# EAGLE design groupe11finis2 (EAGLE 9.3.0)
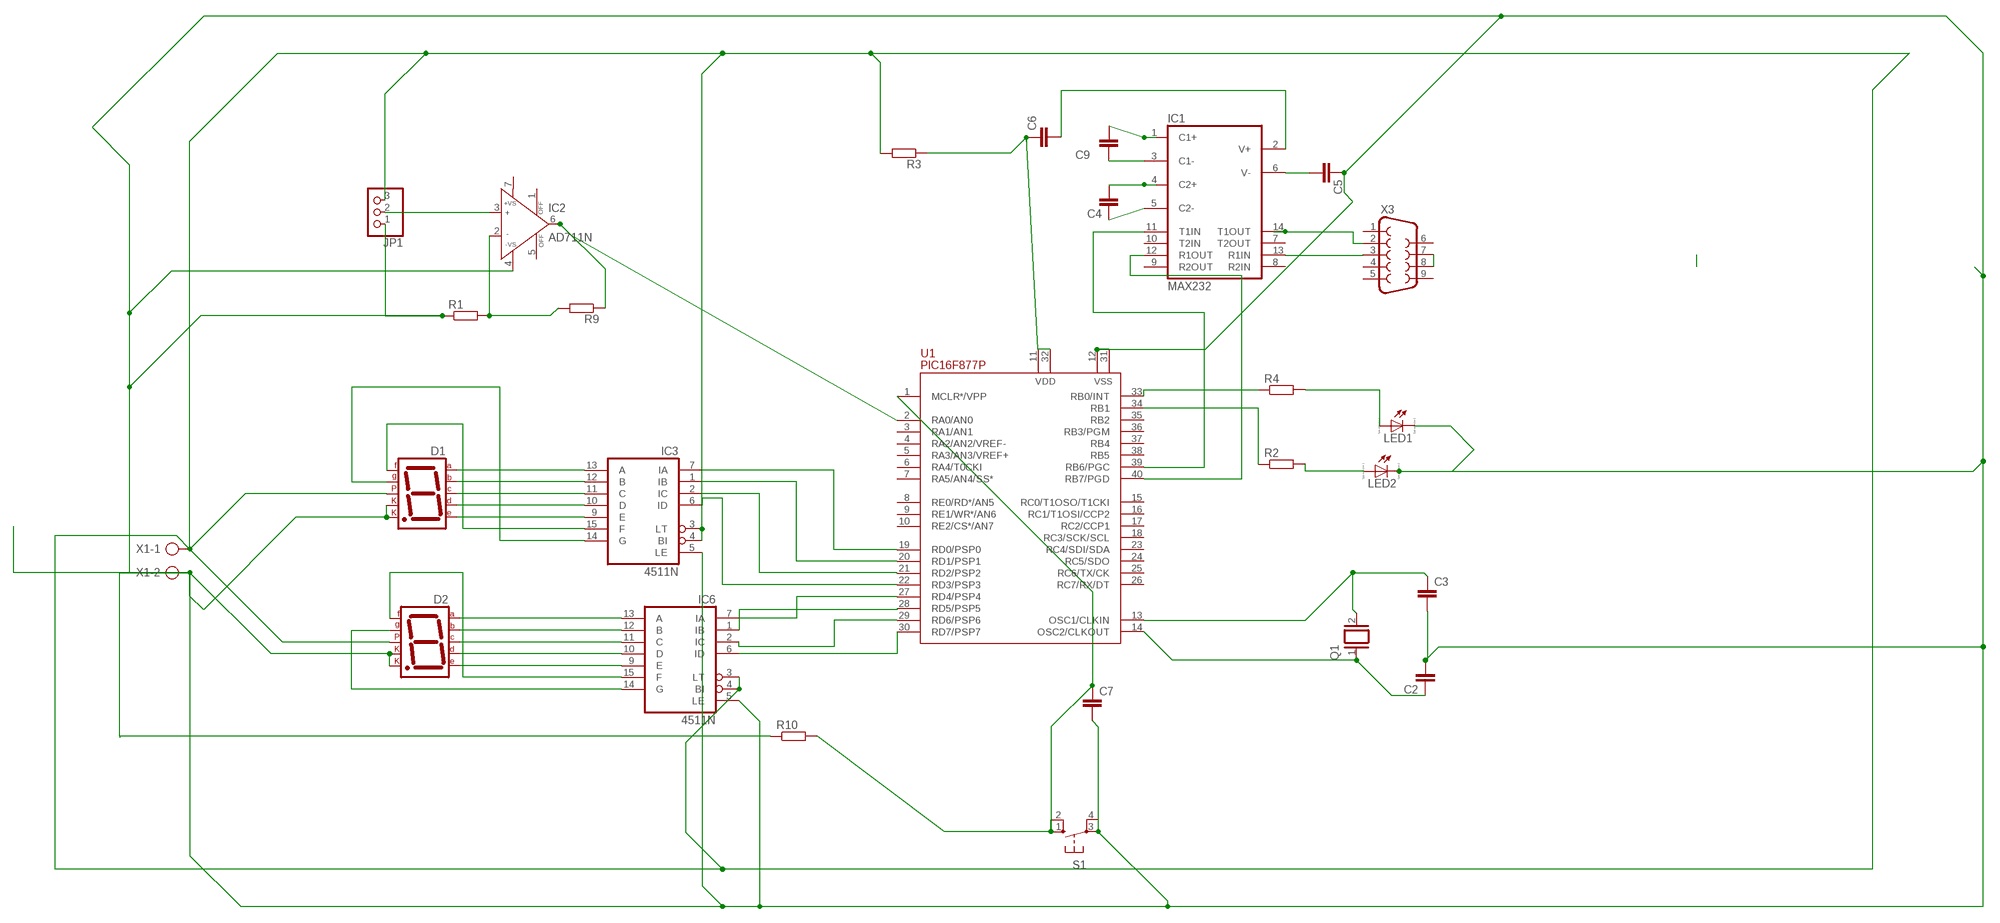
[diagram p0: schematic, sheet 1]

## Parts
C2  C-EU025-024X044  [C025-024X044]
C3  C-EU025-024X044  [C025-024X044]
C4  C-EU025-024X044  [C025-024X044]
C5  C-EU025-024X044  [C025-024X044]
C6  C-EU025-024X044  [C025-024X044]
C7  C-EU025-024X044  [C025-024X044]
C9  C-EU025-024X044  [C025-024X044]
D1  7SEG-CK  [7SEG-13]
D2  7SEG-CK  [7SEG-13]
IC1  MAX232  [DIL16]
IC2  AD711N  [DIL08]
IC3  4511N  [DIL16]
IC6  4511N  [DIL16]
JP1  PINHD-1X3  [1X03]
LED1  LED_ELD260  [LED_LD260]
LED2  LED_ELD260  [LED_LD260]
Q1  XTAL/S  [QS]
R1  R-EU_0207/10  [0207/10]
R2  R-EU_0207/10  [0207/10]
R3  R-EU_0207/10  [0207/10]
R4  R-EU_0207/10  [0207/10]
R9  R-EU_0207/10  [0207/10]
R10  R-EU_0207/10  [0207/10]
S1  10-XX  [B3F-10XX]
U1  PIC16F877P  [DIL40]
X1  AK300/2  [AK300/2]
X3  F09V  [F09V]

## Nets
N$1: IC1.13(R1IN) X3.3
N$2: C9.2 IC1.1(C1+)
N$3: IC1.14(T1OUT) X3.2
N$4: C9.1 IC1.3(C1-)
N$5: IC1.11(T1IN) U1.39(RB6/PGC)
N$6: C4.2 IC1.4(C2+)
N$7: IC1.12(R1OUT) U1.40(RB7/PGD)
N$8: C4.1 IC1.5(C2-)
N$10: C6.2 IC1.2(V+)
N$11: C5.2 IC1.6(V-)
N$12: IC3.7(IA) U1.19(RD0/PSP0)
N$13: IC3.1(IB) U1.20(RD1/PSP1)
N$14: IC3.2(IC) U1.21(RD2/PSP2)
N$15: IC3.6(ID) U1.22(RD3/PSP3)
N$16: IC6.7(IA) U1.27(RD4/PSP4)
N$17: IC6.1(IB) U1.28(RD5/PSP5)
N$18: IC6.2(IC) U1.29(RD6/PSP6)
N$19: IC6.6(ID) U1.30(RD7/PSP7)
N$20: D1.7(A) IC3.13(A)
N$21: D1.6(B) IC3.12(B)
N$22: D1.4(C) IC3.11(C)
N$23: D1.2(D) IC3.10(D)
N$24: D1.1(E) IC3.9(E)
N$25: D1.9(F) IC3.15(F)
N$26: D1.10(G) IC3.14(G)
N$27: D2.7(A) IC6.13(A)
N$28: LED2.A R2.2
N$29: D2.6(B) IC6.12(B)
N$30: R2.1 U1.34(RB1)
N$31: D2.2(D) IC6.10(D)
N$32: D2.1(E) IC6.9(E)
N$33: D2.9(F) IC6.15(F)
N$34: D2.10(G) IC6.14(G)
N$35: R4.1 U1.33(RB0/INT)
N$36: IC2.3(IN+) JP1.2
N$37: LED1.A R4.2
N$38: IC2.2(IN-) R1.2 R9.2
N$39: C3.1 Q1.2 U1.13(OSC1/CLKIN)
N$41: C7.1 R10.2 S1.1(S) S1.2(S1) U1.1(MCLR*/VPP)
N$42: C2.1 Q1.1 U1.14(OSC2/CLKOUT)
N$43: X3.7 X3.8
N$45: IC2.6(OUT) R9.1 U1.2(RA0/AN0)
N$46: C6.1 R3.1 U1.11(VDD) U1.32(VDD)
N$47: D2.4(C) IC6.11(C)
N$52: D1.5(DP) D2.5(DP) IC3.3(LT) IC3.4(BI) IC6.3(LT) IC6.4(BI) JP1.3 R3.2 X1.1
N$53: C2.2 C3.2 C5.1 C7.2 D1.3(CK1) D1.8(CK2) D2.3(CK1) D2.8(CK2) IC2.4(-VS) IC3.5(LE) IC6.5(LE) JP1.1 LED1.K(C) LED2.K(C) R1.1 R10.1 S1.3(P) S1.4(P1) U1.12(VSS) U1.31(VSS) X1.2
Unconnected: IC1.7(T2OUT) IC1.8(R2IN) IC1.9(R2OUT) IC1.10(T2IN) IC2.1(OFF) IC2.5(OFF) IC2.7(+VS) U1.3(RA1/AN1) U1.4(RA2/AN2/VREF-) U1.5(RA3/AN3/VREF+) U1.6(RA4/T0CKI) U1.7(RA5/AN4/SS*) U1.8(RE0/RD*/AN5) U1.9(RE1/WR*/AN6) U1.10(RE2/CS*/AN7) U1.15(RC0/T1OSO/T1CKI) U1.16(RC1/T1OSI/CCP2) U1.17(RC2/CCP1) U1.18(RC3/SCK/SCL) U1.23(RC4/SDI/SDA) U1.24(RC5/SDO) U1.25(RC6/TX/CK) U1.26(RC7/RX/DT) U1.35(RB2) U1.36(RB3/PGM) U1.37(RB4) U1.38(RB5) X3.1 X3.4 X3.5 X3.6 X3.9

## Power pins joined to a net without a drawn wire
GND: IC1.15(GND)
VCC: IC1.16(VCC)
VDD: IC3.16(VDD) IC6.16(VDD)
VSS: IC3.8(VSS) IC6.8(VSS)

## Library data of the parts
C2-C7 C9 = rcl:C-EU: CAPACITOR, European symbol
D1 D2 = special:7SEG-CK: 7-segment DISPLAY single cathode, 13 mm
IC1 = maxim:MAX232: RS232 TRANSCEIVER; MF: MAXIM; MPN: MAX232ACPE+; OC_FARNELL: 9723773; OC_NEWARK: 68K4544
IC2 = analog-devices:AD711: Precision, Low Cost, High Speed, BiFET Op Amp Source: http://www.analog.com/static/imported-files/data_sheets/AD711.pdf; MPN: AD711BQ; OC_FARNELL: 9604839; OC_NEWARK: 66F5826
IC3 IC6 = 45xx:4511: BCD to 7-segment LATCH/DECODER/DRIVER
JP1 = pinhead:PINHD-1X3: PIN HEADER
LED1 LED2 = eagle-ltspice:LED_E: LED Source: http://www.osram.convergy.de Source: www.luxeon.com Source: www.kingbright.com; SPICEMODEL: NONE; SPICEPREFIX: D; SPICETYPE: diode
Q1 = special:XTAL/S: CRYSTAL
R1-R4 R9 R10 = rcl:R-EU_: RESISTOR, European symbol
S1 = switch-omron:10-XX: OMRON SWITCH; MPN: B3F-1000; OC_FARNELL: 176432; OC_NEWARK: 36M3542
U1 = pic16f87x:PIC16F877: FLASH MICROCONTROLLER
X1 = con-ptr500:AK300/2: CONNECTOR; OC_FARNELL: unknown; OC_NEWARK: unknown
X3 = con-subd:F09: SUB-D; OC_FARNELL: unknown; OC_NEWARK: unknown

## Board
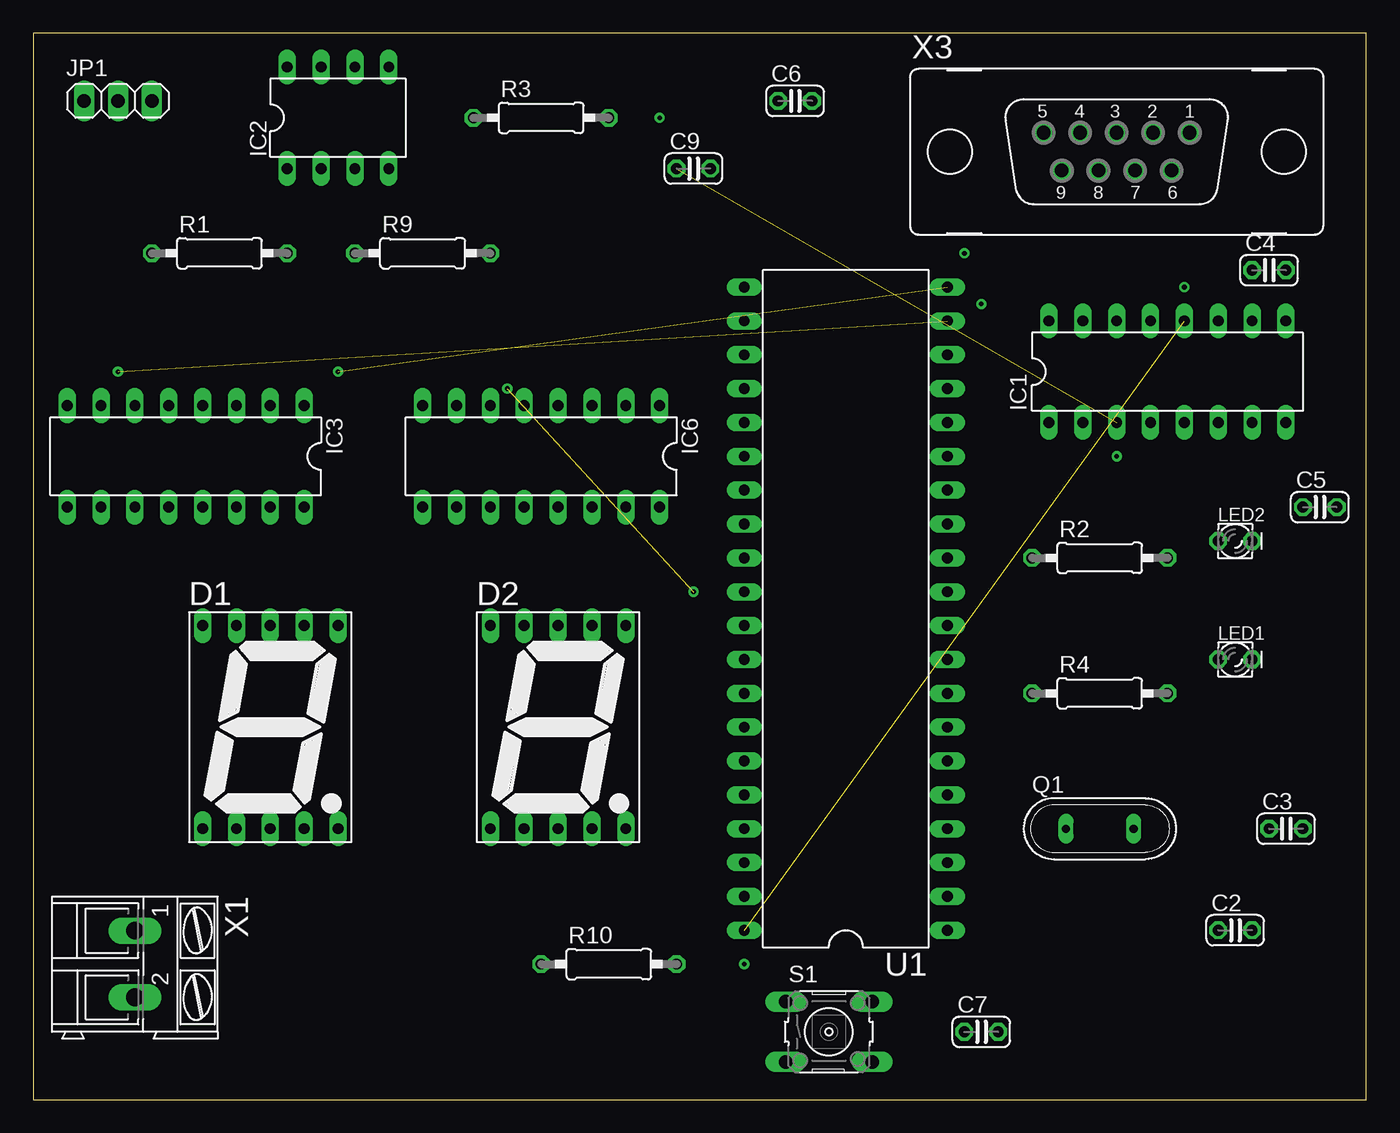
[diagram p1: board, top side]
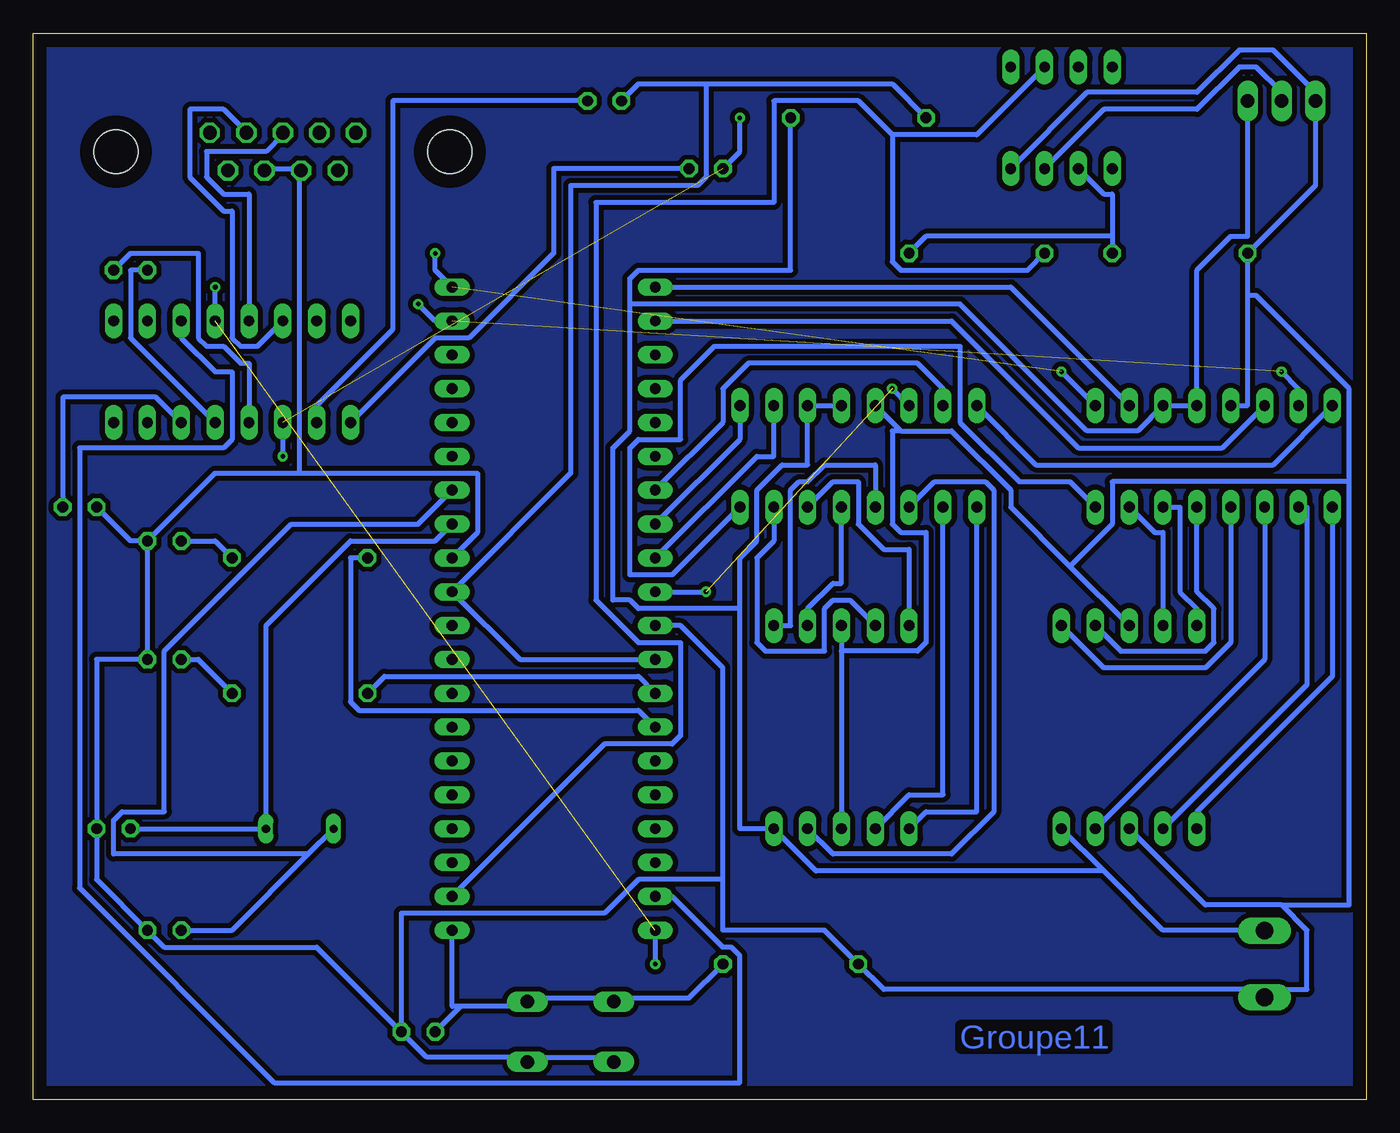
[diagram p2: board, bottom side, seen from below]

Size 100 x 80 mm. Coordinates in mm from the lower left corner, seen from the top.
Outline: 0,0 100,0 100,80 0,80 0,0
Copper layers (1*16): Top 0.035mm / dielectric 1.5mm / Bottom 0.035mm
Design rules "default *": minimum track width 15mil, minimum drill 0.35mm, track to track 15mil, track to pad 15mil, pad to pad 15mil, via to via 15mil, smd to smd 6mil, copper to edge 40mil, drill to drill 6mil, minimum pad ring 10mil, minimum via ring 8mil, stop-mask expansion 4mil, vias tented up to drill 0mil, thermal gap 10mil

### Footprints (pad centres in the part's own frame; a part is rotated, then mirrored left to right if it is on the bottom)
C025-024X044 = drill 0.813 octagon: 1 -1.27,0; 2 1.27,0
7SEG-13 = drill 0.813 long: 1 -5.08,-7.62; 2 -2.54,-7.62; 3 0,-7.62; 4 2.54,-7.62; 5 5.08,-7.62; 6 5.08,7.62; 7 2.54,7.62; 8 0,7.62; 9 -2.54,7.62; 10 -5.08,7.62
DIL16 = drill 0.813 long: 1 -8.89,-3.81; 2 -6.35,-3.81; 3 -3.81,-3.81; 4 -1.27,-3.81; 5 1.27,-3.81; 6 3.81,-3.81; 7 6.35,-3.81; 8 8.89,-3.81; 9 8.89,3.81; 10 6.35,3.81; 11 3.81,3.81; 12 1.27,3.81; 13 -1.27,3.81; 14 -3.81,3.81; 15 -6.35,3.81; 16 -8.89,3.81
DIL08 = drill 0.813 long: 1 -3.81,-3.81; 2 -1.27,-3.81; 3 1.27,-3.81; 4 3.81,-3.81; 5 3.81,3.81; 6 1.27,3.81; 7 -1.27,3.81; 8 -3.81,3.81
1X03 = drill 1.016 long: 1 -2.54,0; 2 0,0; 3 2.54,0
LED_LD260 = drill 0.813 octagon: A -1.27,0; K 1.27,0
QS = drill 0.61 long: 1 -2.54,0; 2 2.54,0
0207/10 = drill 0.813 octagon: 1 -5.08,0; 2 5.08,0
B3F-10XX = drill 1.016 long: 1 -3.251,2.261; 2 3.251,2.261; 3 -3.251,-2.261; 4 3.251,-2.261
DIL40 = drill 0.813 long: 1 -24.13,-7.62; 2 -21.59,-7.62; 3 -19.05,-7.62; 4 -16.51,-7.62; 5 -13.97,-7.62; 6 -11.43,-7.62; 7 -8.89,-7.62; 8 -6.35,-7.62; 9 -3.81,-7.62; 10 -1.27,-7.62; 11 1.27,-7.62; 12 3.81,-7.62; 13 6.35,-7.62; 14 8.89,-7.62; 15 11.43,-7.62; 16 13.97,-7.62; 17 16.51,-7.62; 18 19.05,-7.62; 19 21.59,-7.62; 20 24.13,-7.62; 21 24.13,7.62; 22 21.59,7.62; 23 19.05,7.62; 24 16.51,7.62; 25 13.97,7.62; 26 11.43,7.62; 27 8.89,7.62; 28 6.35,7.62; 29 3.81,7.62; 30 1.27,7.62; 31 -1.27,7.62; 32 -3.81,7.62; 33 -6.35,7.62; 34 -8.89,7.62; 35 -11.43,7.62; 36 -13.97,7.62; 37 -16.51,7.62; 38 -19.05,7.62; 39 -21.59,7.62; 40 -24.13,7.62
AK300/2 = drill 1.321 long: 1 -2.515,0; 2 2.489,0
F09V = drill 1.016 octagon: 1 5.486,1.422; 2 2.743,1.422; 3 0,1.422; 4 -2.743,1.422; 5 -5.486,1.422; 6 4.115,-1.422; 7 1.372,-1.422; 8 -1.372,-1.422; 9 -4.115,-1.422 | hole 3.302: -12.522,0; 12.522,0

### Placement (x,y rotation side)
C2  90.17,12.7 0 top
C3  93.98,20.32 0 top
C4  92.71,62.23 0 top
C5  96.52,44.45 0 top
C6  57.15,74.93 0 top
C7  71.12,5.08 0 top
C9  49.53,69.85 0 top
D1  17.78,27.94 0 top
D2  39.37,27.94 0 top
IC1  85.09,54.61 0 top
IC2  22.86,73.66 0 top
IC3  11.43,48.26 180 top
IC6  38.1,48.26 180 top
JP1  6.35,74.93 0 top
LED1  90.17,33.02 0 top
LED2  90.17,41.91 0 top
Q1  80.01,20.32 0 top
R1  13.97,63.5 0 top
R2  80.01,40.64 0 top
R3  38.1,73.66 0 top
R4  80.01,30.48 0 top
R9  29.21,63.5 0 top
R10  43.18,10.16 0 top
S1  59.69,5.08 0 top
U1  60.96,36.83 90 top
X1  7.62,10.16 270 top
X3  81.28,71.12 0 top

### Tracks (layer width: path | path; a pad name or v marks a point on that pad's centre or on a via)
N$1
  Bottom 0.381: IC1.13 83.82,67.94 85.72,67.94 87,69.22 87,71.12 82.55,71.12 81.28,72.39 X3.3
N$2
  Bottom 0.381: IC1.1 69.85,57.15 67.31,57.15 60.96,63.5 60.96,69.85 C9.2
N$3
  Bottom 0.381: IC1.14 83.19,56.52 84.45,56.52 85.09,57.15 85.09,66.67 85.72,66.67 88.27,69.22 88.27,74.3 85.72,74.3 84.45,73.03 X3.2
N$4  (via drill 0.35)  (1 unrouted)
  Bottom 0.381: IC1.3 v81.28,48.26 | C9.1 46.99,71.12 v46.99,73.66
N$5
  Bottom 0.381: U1.39 52.07,15.24 48.26,11.43 47.62,11.43 46.99,10.79 46.99,1.27 81.92,1.27 96.52,15.88 96.52,48.9 85.72,48.9 85.09,49.53 85.09,54.61 86.36,54.61 88.9,57.15 IC1.11
N$6
  Bottom 0.381: IC1.4 83.82,55.24 84.45,55.24 85.72,56.52 87,56.52 87.63,57.15 87.63,63.5 92.71,63.5 C4.2
N$7  (via drill 0.35)  (1 unrouted)
  Bottom 0.381: U1.40 53.34,10.16 | IC1.12 v86.36,60.96
N$8
  Bottom 0.381: IC1.5 92.71,57.15 92.71,62.23 C4.1
N$10
  Bottom 0.381: IC1.2 78.74,52.07 73.03,57.78 73.03,74.93 C6.2
N$11
  Bottom 0.381: C5.2 97.79,52.7 90.81,52.7 IC1.6
N$12  (via drill 0.35)  (1 unrouted)
  Bottom 0.381: IC3.7 5.08,53.34 v6.35,54.61 | U1.19 69.85,58.42 v71.12,59.69
N$13  (via drill 0.35)  (1 unrouted)
  Bottom 0.381: IC3.1 v22.86,54.61 | U1.20 69.85,62.23 v69.85,63.5
N$14
  Bottom 0.381: IC3.2 26.67,60.96 U1.21
N$15
  Bottom 0.381: IC3.6 10.79,48.9 21.59,48.9 31.11,58.42 U1.22
N$16
  Bottom 0.381: U1.27 48.26,50.8 48.26,53.34 46.35,55.24 33.66,55.24 31.75,53.34 IC6.7
N$17
  Bottom 0.381: U1.28 46.99,49.53 IC6.1
N$18
  Bottom 0.381: IC6.2 44.45,48.26 45.72,48.26 U1.29
N$19  (via drill 0.35)  (1 unrouted)
  Bottom 0.381: U1.30 v49.53,38.1 | IC6.6 v35.56,53.34
N$20
  Bottom 0.381: IC3.13 12.7,38.1 11.43,36.83 11.43,34.29 12.06,33.66 18.41,33.66 D1.7
N$21
  Bottom 0.381: D1.6 19.68,32.38 12.06,32.38 10.16,34.29 IC3.12
N$22
  Bottom 0.381: D1.4 7.62,33.02 IC3.11
N$23
  Bottom 0.381: D1.2 4.45,31.11 4.45,44.45 IC3.10
N$24
  Bottom 0.381: D1.1 12.7,21.59 2.54,31.75 IC3.9
N$25
  Bottom 0.381: D1.9 15.24,42.55 15.88,42.55 IC3.15
N$26
  Bottom 0.381: D1.10 12.7,36.83 13.97,38.1 13.97,44.45 IC3.14
N$27
  Bottom 0.381: IC6.13 39.37,38.73 40.01,38.73 41.91,36.83 D2.7
N$28
  Bottom 0.381: R2.2 86.36,41.91 LED2.A
N$29
  Bottom 0.381: IC6.12 36.83,47.62 40.64,47.62 41.91,46.35 42.55,46.35 43.18,45.72 43.18,35.56 D2.6
N$30
  Bottom 0.381: U1.34 54.61,29.21 75.56,29.21 76.2,29.84 76.2,40.64 R2.1
N$31
  Bottom 0.381: IC6.10 31.75,22.86 34.29,22.86 D2.2
N$32
  Bottom 0.381: IC6.9 29.21,21.59 33.02,21.59 D2.1
N$33
  Bottom 0.381: D2.9 38.73,37.47 40.01,37.47 40.64,36.83 40.64,33.66 45.09,33.66 45.72,34.29 45.72,40.64 44.45,41.91 IC6.15
N$34
  Bottom 0.381: D2.10 34.29,41.27 36.2,41.27 38.1,43.18 38.1,46.35 40.01,46.35 IC6.14
N$35
  Bottom 0.381: U1.33 54.61,31.75 73.66,31.75 R4.1
N$36
  Bottom 0.381: IC2.3 19.68,74.3 12.7,74.3 9.53,77.47 8.26,77.47 6.35,75.56 JP1.2
N$37
  Bottom 0.381: R4.2 87.63,33.02 LED1.A
N$38
  Bottom 0.381: 19.05,64.77 19.05,67.94 19.68,67.94 IC2.2 | 19.05,64.77 R1.2 | R9.2 33.02,64.77 19.05,64.77
N$39
  Bottom 0.381: C3.1 Q1.2 82.55,35.56 76.2,41.91 69.85,41.91 U1.13
N$40  (via drill 0.35)
  other vias: 53.34,10.16
N$41
  Bottom 0.381: R10.2 50.8,7.62 55.88,7.62 S1.1 56.52,7.62 62.87,7.62 S1.2 63.5,6.99 67.94,6.99 | 67.94,6.99 C7.1 | U1.1 68.58,6.99 67.94,6.99
N$42
  Bottom 0.381: 79.38,18.41 85.09,12.7 C2.1 | 79.38,18.41 Q1.1 | U1.14 71.12,43.18 80.64,43.18 90.17,33.66 90.17,21.59 93.34,21.59 93.98,20.95 93.98,18.41 79.38,18.41
N$43
  Bottom 0.381: X3.8 80.01,69.85 82.55,69.85 X3.7
N$45
  Bottom 0.381: R9.1 25.4,62.23 34.92,62.23 35.56,62.87 35.56,72.39 | 35.56,72.39 29.21,72.39 IC2.6 | U1.2 57.15,26.67 52.07,26.67 51.44,27.3 51.44,34.29 54.61,34.29 57.78,37.47 57.78,67.31 44.45,67.31 44.45,74.93 38.1,74.93 35.56,72.39
N$46
  Bottom 0.381: U1.32 63.5,33.02 U1.11 59.69,46.99 59.69,68.58 50.16,68.58 49.53,69.22 49.53,76.2 | R3.1 35.56,76.2 49.53,76.2 | 49.53,76.2 54.61,76.2 C6.1
N$47
  Bottom 0.381: D2.4 40.01,18.41 31.11,18.41 27.94,21.59 27.94,45.72 28.57,46.35 32.38,46.35 IC6.11
N$52
  Bottom 0.381: R3.2 43.18,62.23 54.61,62.23 55.24,61.59 55.24,59.69 | 55.24,59.69 30.48,59.69 20.95,50.16 17.14,50.16 IC3.3 IC3.4 12.7,62.23 10.16,64.77 8.89,64.77 JP1.3 | IC6.4 IC6.3 41.91,47.62 43.81,47.62 45.72,45.72 45.72,41.91 46.99,40.64 46.99,36.83 | 19.68,17.14 15.24,12.7 7.62,12.7 X1.1 | 19.68,17.14 D1.5 | 19.68,17.14 41.27,17.14 D2.5 46.99,20.32 46.99,36.83 | 55.24,59.69 55.24,50.16 56.52,48.9 56.52,37.47 55.24,37.47 54.61,36.83 46.99,36.83
N$53
  Bottom 0.381: C7.2 70.48,3.17 63.5,3.17 S1.4 62.87,3.17 56.52,3.17 S1.3 | U1.12 66.67,42.55 66.67,46.99 80.01,46.99 | 80.01,46.99 86.36,46.99 LED2.K | LED2.K LED1.K 95.25,33.02 C3.2 95.25,16.51 C2.2 90.17,11.43 78.74,11.43 C7.2 | C5.1 92.71,41.91 LED2.K | 80.01,46.99 80.01,69.22 | D2.8 39.37,33.66 | 39.37,33.66 D2.3 | 22.23,40.01 26.67,44.45 26.67,45.72 31.11,50.16 34.92,50.16 | 22.23,40.01 D1.8 | IC6.5 34.92,50.16 | 39.37,33.66 33.66,33.66 33.02,34.29 33.02,42.55 34.92,42.55 35.56,43.18 35.56,50.16 34.92,50.16 | 8.89,60.33 8.89,52.07 IC3.5 | 8.89,60.33 R1.1 3.81,68.58 JP1.1 3.81,75.56 6.99,78.74 9.53,78.74 12.7,75.56 20.95,75.56 IC2.4 | D1.3 12.06,14.61 6.35,14.61 | 6.35,14.61 4.45,12.7 4.45,8.26 7.62,8.26 | 7.62,8.26 36.2,8.26 R10.1 40.64,12.7 48.26,12.7 48.26,16.51 | 7.62,8.26 X1.2 | U1.31 51.44,35.56 48.26,32.38 48.26,16.51 | 8.89,60.33 8.26,60.33 1.27,53.34 1.27,46.35 | 1.27,46.35 1.27,14.61 6.35,14.61 | 22.23,40.01 19.05,43.18 19.05,46.35 1.27,46.35 | C7.2 72.39,13.97 57.15,13.97 54.61,16.51 48.26,16.51
VDD
  Bottom 0.381: IC3.16 22.23,46.35 26.04,46.35 30.48,50.8 30.48,56.52 48.9,56.52 51.44,53.98 51.44,49.53 54.61,49.53 55.24,48.9 55.24,39.37 52.07,39.37 IC6.16
VSS
  Bottom 0.381: IC3.8 6.99,47.62 24.77,47.62 IC6.8
YO
  pour Bottom (isolate 0.02): 100.33,80.01 100.33,0 0,0 0,80.01

### Text on the board
Bottom: Groupe11